# Altium schematic sheet FPGA_IO.SchDoc
size A
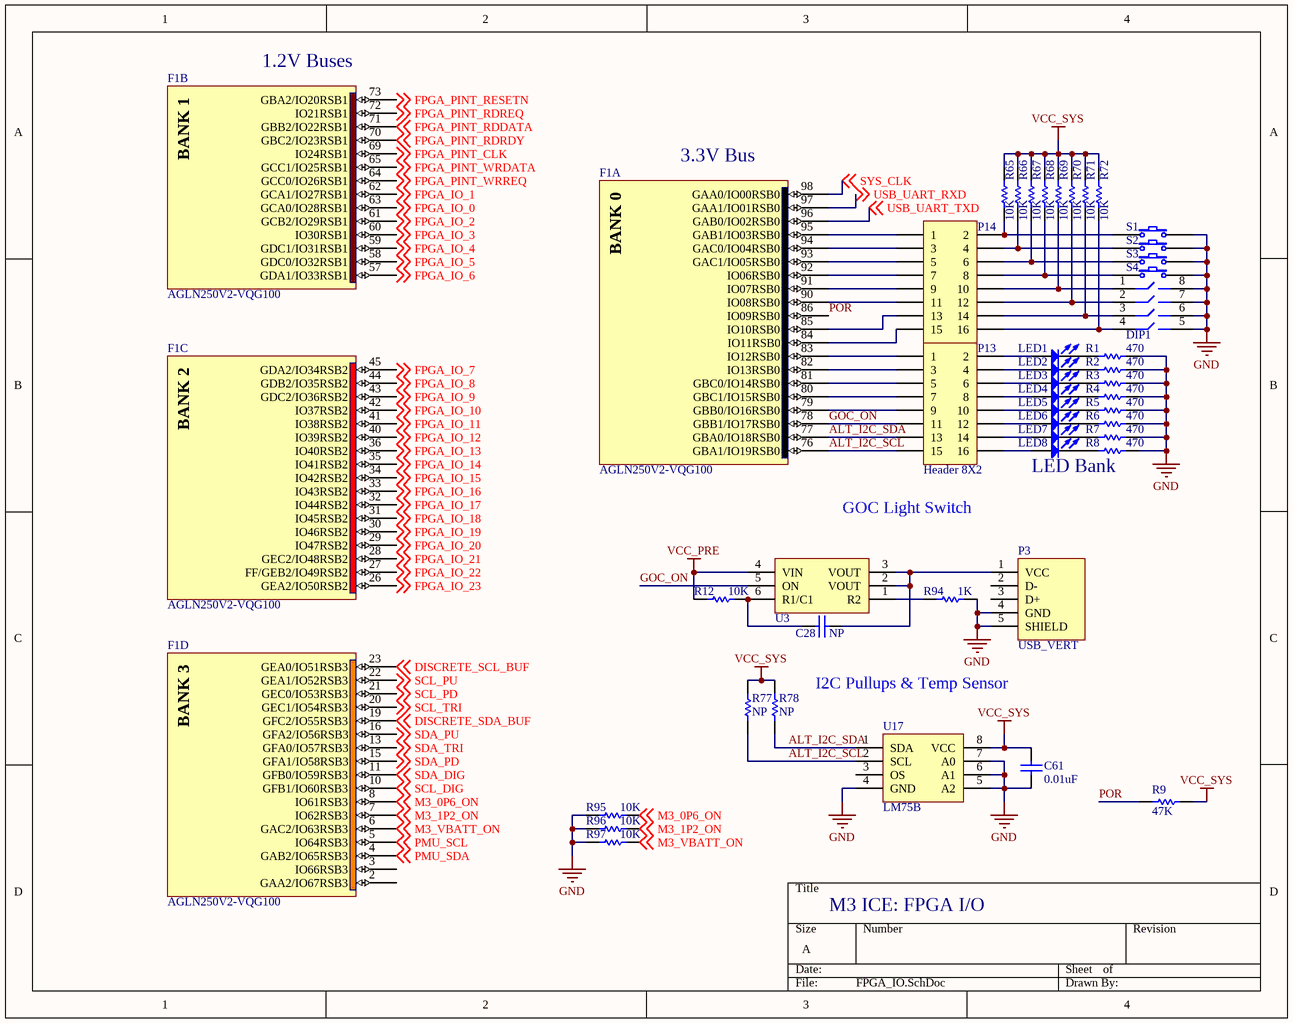
[diagram p0: FPGA_IO.SchDoc]

## Parts
C28  value NP  [0402]  (hidden comment: Cap Semi)
C61  value 0.01uF  [1608[0603]]  (hidden comment: Cap Semi)
DIP1  ADE0404  [DIP-8]  (value not drawn)
F1  AGLN250V2-VQG100  [VQ100_N]  (parts A,B,C,D of 8)
LED1  LED 1206  [1206_LED]  (value not drawn)
LED2  LED 1206  [1206_LED]  (value not drawn)
LED3  LED 1206  [1206_LED]  (value not drawn)
LED4  LED 1206  [1206_LED]  (value not drawn)
LED5  LED 1206  [1206_LED]  (value not drawn)
LED6  LED 1206  [1206_LED]  (value not drawn)
LED7  LED 1206  [1206_LED]  (value not drawn)
LED8  LED 1206  [1206_LED]  (value not drawn)
P3  USB_VERT  [USB_VERT]
P13  Header 8X2  [HDR2X8]
P14  Header 8X2  [HDR2X8]  (value not drawn)
R1  value 470  [0603]  (hidden comment: Res Chip)
R2  value 470  [0603]  (hidden comment: Res Chip)
R3  value 470  [0603]  (hidden comment: Res Chip)
R4  value 470  [0603]  (hidden comment: Res Chip)
R5  value 470  [0603]  (hidden comment: Res Chip)
R6  value 470  [0603]  (hidden comment: Res Chip)
R7  value 470  [0603]  (hidden comment: Res Chip)
R8  value 470  [0603]  (hidden comment: Res Chip)
R9  value 47K  [0603]  (hidden comment: Res Chip)
R12  value 10K  [0402]  (hidden comment: Res Chip)
R65  value 10K  [0603]  (hidden comment: Res Chip)
R66  value 10K  [0603]  (hidden comment: Res Chip)
R67  value 10K  [0603]  (hidden comment: Res Chip)
R68  value 10K  [0603]  (hidden comment: Res Chip)
R69  value 10K  [0603]  (hidden comment: Res Chip)
R70  value 10K  [0603]  (hidden comment: Res Chip)
R71  value 10K  [0603]  (hidden comment: Res Chip)
R72  value 10K  [0603]  (hidden comment: Res Chip)
R77  value NP  [0603]  (hidden comment: Res Chip)
R78  value NP  [0603]  (hidden comment: Res Chip)
R94  value 1K  [0402]  (hidden comment: Res Chip)
R95  value 10K  [0402]  (hidden comment: Res Chip)
R96  value 10K  [0402]  (hidden comment: Res Chip)
R97  value 10K  [0402]  (hidden comment: Res Chip)
S1  EVQ-PAE04M  [EVQPA]  (value not drawn)
S2  EVQ-PAE04M  [EVQPA]  (value not drawn)
S3  EVQ-PAE04M  [EVQPA]  (value not drawn)
S4  EVQ-PAE04M  [EVQPA]  (value not drawn)
U3  FDC6330L  [SUPERSOT-6]  (value not drawn)
U17  LM75B  [SO8]

## Nets
GND: C61.1 DIP1.5 DIP1.6 DIP1.7 DIP1.8 P3.4(GND) P3.5(SHIELD) R1.1 R2.1 R3.1 R4.1 R5.1 R6.1 R7.1 R8.1 R94.2 R95.2 R96.2 R97.2 S1.2 S2.2 S3.2 S4.2 U17.4(GND) U17.5(A2) U17.6(A1) U17.7(A0)
VCC_PRE: R12.1 U3.4(VIN)
VCC_SYS: C61.2 R9.2 R65.1 R66.1 R67.1 R68.1 R69.1 R70.1 R71.1 R72.1 R77.1 R78.1 U17.8(VCC)
ALT_I2C_SCL: F1.76(GBA1/IO19RSB0) P13.15 R77.2 U17.2(SCL)
ALT_I2C_SDA: F1.77(GBA0/IO18RSB0) P13.13 R78.2 U17.1(SDA)
DISCRETE_SCL_BUF: F1.23(GEA0/IO51RSB3) ; off-sheet DISCRETE_SCL_BUF
DISCRETE_SDA_BUF: F1.19(GFC2/IO55RSB3) ; off-sheet DISCRETE_SDA_BUF
FPGA_IO_0: F1.63(GCA0/IO28RSB1) ; off-sheet FPGA_IO_0
FPGA_IO_1: F1.62(GCA1/IO27RSB1) ; off-sheet FPGA_IO_1
FPGA_IO_2: F1.61(GCB2/IO29RSB1) ; off-sheet FPGA_IO_2
FPGA_IO_3: F1.60(IO30RSB1) ; off-sheet FPGA_IO_3
FPGA_IO_4: F1.59(GDC1/IO31RSB1) ; off-sheet FPGA_IO_4
FPGA_IO_5: F1.58(GDC0/IO32RSB1) ; off-sheet FPGA_IO_5
FPGA_IO_6: F1.57(GDA1/IO33RSB1) ; off-sheet FPGA_IO_6
FPGA_IO_7: F1.45(GDA2/IO34RSB2) ; off-sheet FPGA_IO_7
FPGA_IO_8: F1.44(GDB2/IO35RSB2) ; off-sheet FPGA_IO_8
FPGA_IO_9: F1.43(GDC2/IO36RSB2) ; off-sheet FPGA_IO_9
FPGA_IO_10: F1.42(IO37RSB2) ; off-sheet FPGA_IO_10
FPGA_IO_11: F1.41(IO38RSB2) ; off-sheet FPGA_IO_11
FPGA_IO_12: F1.40(IO39RSB2) ; off-sheet FPGA_IO_12
FPGA_IO_13: F1.36(IO40RSB2) ; off-sheet FPGA_IO_13
FPGA_IO_14: F1.35(IO41RSB2) ; off-sheet FPGA_IO_14
FPGA_IO_15: F1.34(IO42RSB2) ; off-sheet FPGA_IO_15
FPGA_IO_16: F1.33(IO43RSB2) ; off-sheet FPGA_IO_16
FPGA_IO_17: F1.32(IO44RSB2) ; off-sheet FPGA_IO_17
FPGA_IO_18: F1.31(IO45RSB2) ; off-sheet FPGA_IO_18
FPGA_IO_19: F1.30(IO46RSB2) ; off-sheet FPGA_IO_19
FPGA_IO_20: F1.29(IO47RSB2) ; off-sheet FPGA_IO_20
FPGA_IO_21: F1.28(GEC2/IO48RSB2) ; off-sheet FPGA_IO_21
FPGA_IO_22: F1.27(FF/GEB2/IO49RSB2) ; off-sheet FPGA_IO_22
FPGA_IO_23: F1.26(GEA2/IO50RSB2) ; off-sheet FPGA_IO_23
FPGA_PINT_CLK: F1.69(IO24RSB1) ; off-sheet FPGA_PINT_CLK
FPGA_PINT_RDDATA: F1.71(GBB2/IO22RSB1) ; off-sheet FPGA_PINT_RDDATA
FPGA_PINT_RDRDY: F1.70(GBC2/IO23RSB1) ; off-sheet FPGA_PINT_RDRDY
FPGA_PINT_RDREQ: F1.72(IO21RSB1) ; off-sheet FPGA_PINT_RDREQ
FPGA_PINT_RESETN: F1.73(GBA2/IO20RSB1) ; off-sheet FPGA_PINT_RESETN
FPGA_PINT_WRDATA: F1.65(GCC1/IO25RSB1) ; off-sheet FPGA_PINT_WRDATA
FPGA_PINT_WRREQ: F1.64(GCC0/IO26RSB1) ; off-sheet FPGA_PINT_WRREQ
GOC_ON: F1.78(GBB1/IO17RSB0) P13.11 U3.5(ON)
M3_0P6_ON: F1.8(IO61RSB3) R95.1 ; off-sheet M3_0P6_ON
M3_1P2_ON: F1.7(IO62RSB3) R96.1 ; off-sheet M3_1P2_ON
M3_VBATT_ON: F1.6(GAC2/IO63RSB3) R97.1 ; off-sheet M3_VBATT_ON
PMU_SCL: F1.5(IO64RSB3) ; off-sheet PMU_SCL
PMU_SDA: F1.4(GAB2/IO65RSB3) ; off-sheet PMU_SDA
POR: F1.86(IO09RSB0) R9.1
SCL_DIG: F1.10(GFB1/IO60RSB3) ; off-sheet SCL_DIG
SCL_PD: F1.21(GEC0/IO53RSB3) ; off-sheet SCL_PD
SCL_PU: F1.22(GEA1/IO52RSB3) ; off-sheet SCL_PU
SCL_TRI: F1.20(GEC1/IO54RSB3) ; off-sheet SCL_TRI
SDA_DIG: F1.11(GFB0/IO59RSB3) ; off-sheet SDA_DIG
SDA_PD: F1.15(GFA1/IO58RSB3) ; off-sheet SDA_PD
SDA_PU: F1.16(GFA2/IO56RSB3) ; off-sheet SDA_PU
SDA_TRI: F1.13(GFA0/IO57RSB3) ; off-sheet SDA_TRI
SYS_CLK: F1.98(GAA0/IO00RSB0) ; off-sheet SYS_CLK
USB_UART_RXD: F1.97(GAA1/IO01RSB0) ; off-sheet USB_UART_RXD
USB_UART_TXD: F1.96(GAB0/IO02RSB0) ; off-sheet USB_UART_TXD
NetC28_1: C28.1 P3.1(VCC) U3.2(VOUT) U3.3(VOUT)
NetC28_2: C28.2 R12.2 U3.6(R1/C1)
NetDIP1_1: DIP1.1 P14.10 R69.2
NetDIP1_2: DIP1.2 P14.12 R70.2
NetDIP1_3: DIP1.3 P14.14 R71.2
NetDIP1_4: DIP1.4 P14.16 R72.2
NetF1_79: F1.79(GBB0/IO16RSB0) P13.9
NetF1_80: F1.80(GBC1/IO15RSB0) P13.7
NetF1_81: F1.81(GBC0/IO14RSB0) P13.5
NetF1_82: F1.82(IO13RSB0) P13.3
NetF1_83: F1.83(IO12RSB0) P13.1
NetF1_84: F1.84(IO11RSB0) P14.15
NetF1_85: F1.85(IO10RSB0) P14.13
NetF1_90: F1.90(IO08RSB0) P14.11
NetF1_91: F1.91(IO07RSB0) P14.9
NetF1_92: F1.92(IO06RSB0) P14.7
NetF1_93: F1.93(GAC1/IO05RSB0) P14.5
NetF1_94: F1.94(GAC0/IO04RSB0) P14.3
NetF1_95: F1.95(GAB1/IO03RSB0) P14.1
NetLED1_1: LED1.1(A) P13.2
NetLED1_2: LED1.2(K) R1.2
NetLED2_1: LED2.1(A) P13.4
NetLED2_2: LED2.2(K) R2.2
NetLED3_1: LED3.1(A) P13.6
NetLED3_2: LED3.2(K) R3.2
NetLED4_1: LED4.1(A) P13.8
NetLED4_2: LED4.2(K) R4.2
NetLED5_1: LED5.1(A) P13.10
NetLED5_2: LED5.2(K) R5.2
NetLED6_1: LED6.1(A) P13.12
NetLED6_2: LED6.2(K) R6.2
NetLED7_1: LED7.1(A) P13.14
NetLED7_2: LED7.2(K) R7.2
NetLED8_1: LED8.1(A) P13.16
NetLED8_2: LED8.2(K) R8.2
NetP14_2: P14.2 R65.2 S1.1
NetP14_4: P14.4 R66.2 S2.1
NetP14_6: P14.6 R67.2 S3.1
NetP14_8: P14.8 R68.2 S4.1
NetR94_1: R94.1 U3.1(R2)

Not connected (* = marked no-connect by the designer): F1 2(GAA2/IO67RSB3) 3(IO66RSB3); P3 2(D-) 3(D+); U17 3(OS)

## Notes on the sheet
- (near F1) 1.2V Buses
- (near F1) 3.3V Bus
- LED Bank
- GOC Light Switch
- I2C Pullups & Temp Sensor
- M3 ICE: FPGA I/O
- (in symbol AGLN250V2-VQG100, part A) BANK 0
- (in symbol AGLN250V2-VQG100, part B) BANK 1
- (in symbol AGLN250V2-VQG100, part C) BANK 2
- (in symbol AGLN250V2-VQG100, part D) BANK 3

## Library data of the parts
C28 = Cap Semi: Capacitor (Semiconductor SIM Model); Published: 8-Jun-2000; LatestRevisionDate: 29-May-2009; LatestRevisionNote: IPC-7351 Footprint Added.; PackageReference: C1206; Publisher: Altium Limited; PackageDescription: Chip Capacitor
C61 = Cap Semi: Capacitor (Semiconductor SIM Model); DistPartNo: 445-1311-1-ND; ManPartNo: C1608X7R1H103K; Published: 8-Jun-2000; LatestRevisionDate: 29-May-2009; LatestRevisionNote: IPC-7351 Footprint Added.; PackageReference: C1206; Publisher: Altium Limited; PackageDescription: Chip Capacitor
DIP1 = ADE0404: 4-DIP Switch; DistPartNo: 450-1364-ND; PackageReference: DIP-8; ManPartNo: ADE0404
F1 = AGLN250V2-VQG100: IGLOO nano Low-Power Flash 1.2 to 1.5V FPGA with Flash*Freeze, 68 User IOs, 250K System Gates, 1Kbit Flash ROM, 100-Pin TQFP, Commercial Grade, Pb-Free; DistPartNo: 1100-1134-ND; Published: 29-May-2009; DatasheetVersion: Feb-2009; PackageVersion: v11.0, Feb-2009; PackageReference: VQ100; Publisher: Altium Limited; PackageDescription: 100-Pin Plastic Quad Flat Pack (VQ100); Code_JEDEC: MS-026-AED; ComponentLink1Description: Manufacturer Link; ComponentLink1URL: http://www.actel.com/products/igloonano/default.aspx; ComponentLink2Description: Datasheet; ComponentLink2URL: http://www.actel.com/documents/IGLOO_nano_DS.pdf; ManPartNo: AGLN250V2-VQG100
LED1-LED8 = LED 1206: DistPartNo: 160-1169-1-ND; ManPartNo: LTST-C150GKT
P3 = USB_VERT: DistPartNo: ED2987-ND; ManPartNo: USB-A1VSW6
P13 P14 = Header 8X2: Header, 8-Pin, Dual row; LatestRevisionDate: 17-Jul-2002; LatestRevisionNote: Re-released for DXP Platform.; Publisher: Altium Limited
R1-R8 = Res Chip: Semiconductor Resistor; DistPartNo: P470GCT-ND; ManPartNo: ERJ-3GEYJ471V; Published: 8-Jun-2000; LatestRevisionDate: 17-Jul-2002; LatestRevisionNote: Re-released for DXP Platform.; PackageReference: AXIAL-0.5; Publisher: Altium Limited; PackageDescription: Axial Device, Thru-Hole; 2 Leads; 0.5 in Pin Spacing
R9 = Res Chip: Semiconductor Resistor; DistPartNo: P47KGCT-ND; ManPartNo: ERJ-3GEYJ103V; Published: 8-Jun-2000; LatestRevisionDate: 17-Jul-2002; LatestRevisionNote: Re-released for DXP Platform.; PackageReference: AXIAL-0.5; Publisher: Altium Limited; PackageDescription: Axial Device, Thru-Hole; 2 Leads; 0.5 in Pin Spacing
R12 = Res Chip: Semiconductor Resistor; ManPartNo: ERJ-2RKF1002X; DistPartNo: P10.0KLCT-ND; Published: 8-Jun-2000; LatestRevisionDate: 17-Jul-2002; LatestRevisionNote: Re-released for DXP Platform.; PackageReference: AXIAL-0.5; Publisher: Altium Limited; PackageDescription: Axial Device, Thru-Hole; 2 Leads; 0.5 in Pin Spacing
R65-R72 = Res Chip: Semiconductor Resistor; DistPartNo: P10KGCT-ND; ManPartNo: ERJ-3GEYJ103V; Published: 8-Jun-2000; LatestRevisionDate: 17-Jul-2002; LatestRevisionNote: Re-released for DXP Platform.; PackageReference: AXIAL-0.5; Publisher: Altium Limited; PackageDescription: Axial Device, Thru-Hole; 2 Leads; 0.5 in Pin Spacing
R77 R78 = Res Chip: Semiconductor Resistor; DistPartNo: NONE; Published: 8-Jun-2000; LatestRevisionDate: 17-Jul-2002; LatestRevisionNote: Re-released for DXP Platform.; PackageReference: AXIAL-0.5; Publisher: Altium Limited; PackageDescription: Axial Device, Thru-Hole; 2 Leads; 0.5 in Pin Spacing; ManPartNo: NONE
R94 = Res Chip: Semiconductor Resistor; ManPartNo: ERJ-2RKF1001X; DistPartNo: P1.00KLCT-ND; Published: 8-Jun-2000; LatestRevisionDate: 17-Jul-2002; LatestRevisionNote: Re-released for DXP Platform.; PackageReference: AXIAL-0.5; Publisher: Altium Limited; PackageDescription: Axial Device, Thru-Hole; 2 Leads; 0.5 in Pin Spacing
R95-R97 = Res Chip: Semiconductor Resistor; DistPartNo: P10.0KLCT-ND; ManPartNo: ERJ-2RKF1002X; Published: 8-Jun-2000; LatestRevisionDate: 17-Jul-2002; LatestRevisionNote: Re-released for DXP Platform.; PackageReference: AXIAL-0.5; Publisher: Altium Limited; PackageDescription: Axial Device, Thru-Hole; 2 Leads; 0.5 in Pin Spacing
S1-S4 = EVQ-PAE04M: Switch Push; DistPartNo: P8008S-ND; ManPartNo: EVQ-PAE04M
U3 = FDC6330L: HS Switch; DistPartNo: FDC6330LCT-ND; ManPartNo: FDC6330L
U17 = LM75B: I2C Temp Sensor; DistPartNo: 568-4688-1-ND; ManPartNo: LM75BD,118